# Altium project PCB_15122020_01CA.PrjPcb (part 7 of 7)

## Sheet LCD.SchDoc
size A4
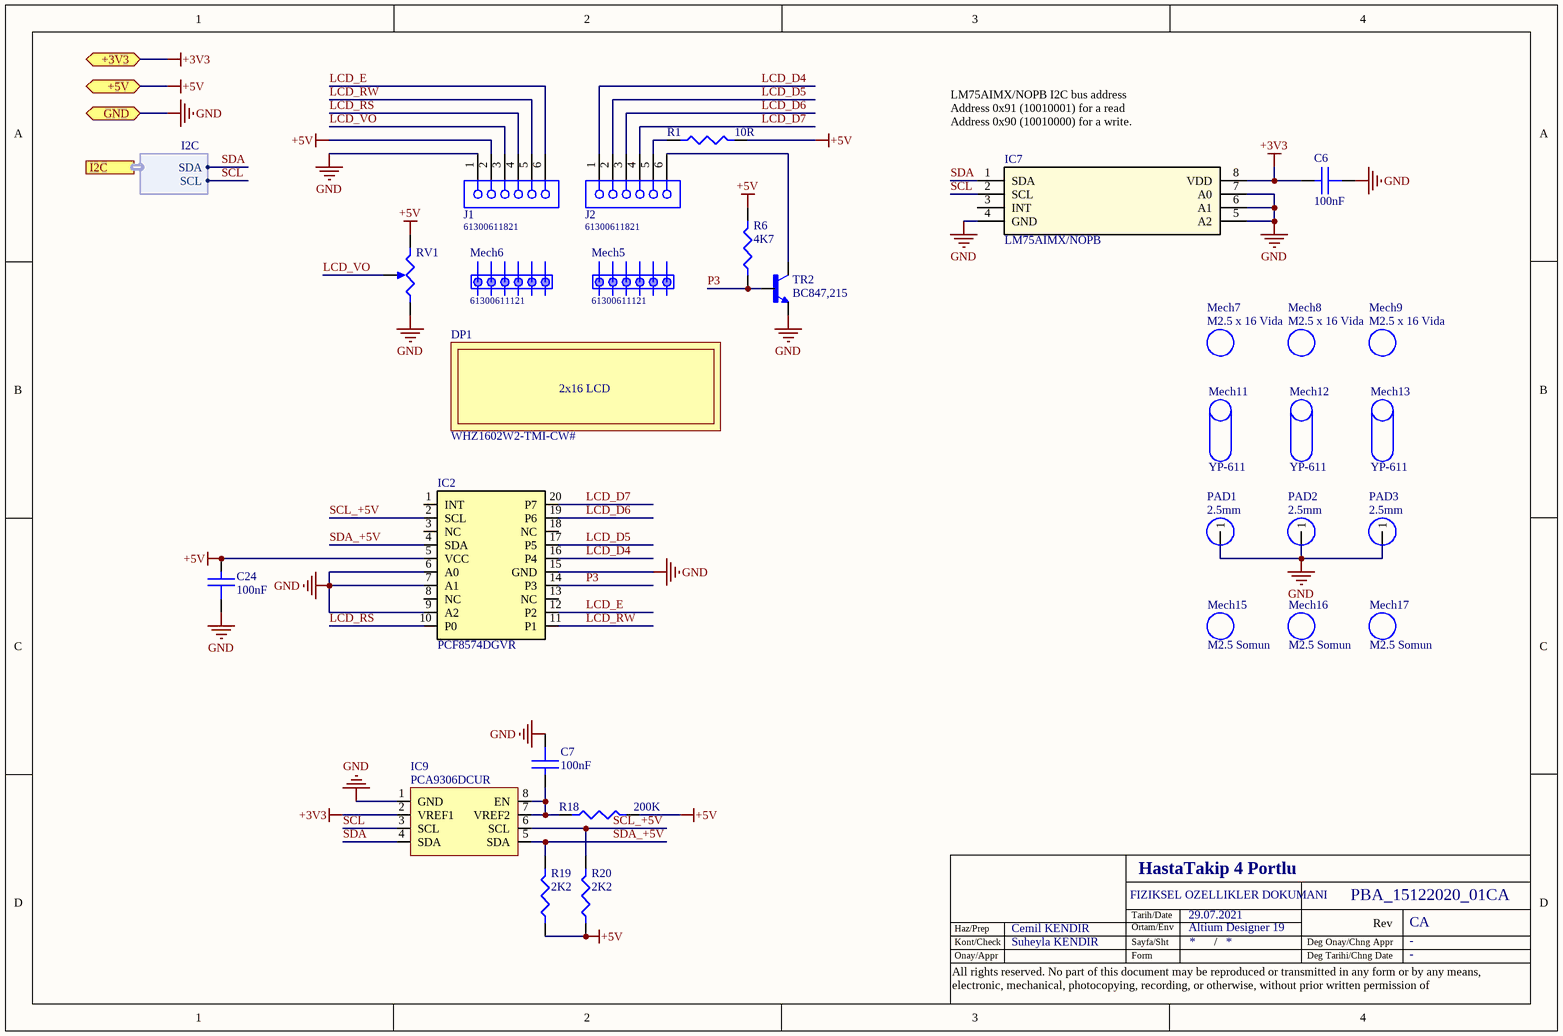
[diagram p6: LCD.SchDoc]

### Parts
C6  100nF  [C0603]
C7  100nF  [C0603]
C24  100nF  [C0603]
DP1  WHZ1602W2-TMI-CW#  [WHZ1602W2-TMI-CW#]
IC2  PCF8574DGVR  [DGV20]
IC7  LM75AIMX/NOPB  [SO08]
IC9  PCA9306DCUR  [SOP50P310X90-8N]
J1  61300611821  [61300611821]
J2  61300611821  [61300611821]
Mech5  61300611121  [61300611121]
Mech6  61300611121  [61300611121]
Mech7  M2.5 x 16 Vida  [M2.5 x 16]
Mech8  M2.5 x 16 Vida  [M2.5 x 16]
Mech9  M2.5 x 16 Vida  [M2.5 x 16]
Mech11  YP-611  [YP-611 - 11 mm]
Mech12  YP-611  [YP-611 - 11 mm]
Mech13  YP-611  [YP-611 - 11 mm]
Mech15  M2.5 Somun  [M2.5]
Mech16  M2.5 Somun  [M2.5]
Mech17  M2.5 Somun  [M2.5]
PAD1  2.5mm  [2.5mm x 5mm]
PAD2  2.5mm  [2.5mm x 5mm]
PAD3  2.5mm  [2.5mm x 5mm]
R1  10R  [R0603]
R6  4K7  [R0603]
R18  200K  [R0603]
R19  2K2  [R0603]
R20  2K2  [R0603]
RV1  L-KLS4-WH06-2A-103  [L-KLS4-WH06-2A-103]  (value not drawn)
TR2  BC847,215  [SOT23]

### Ports
+3V3 (bidir), +5V (bidir), GND (bidir), I2C (harness I2C)

### Harnesses
I2C: SCL, SDA

### Nets
+3V3: C6.1 IC7.8(VDD) IC9.2(VREF1) ; port +3V3
+5V: C24.1 IC2.5(VCC) J1.2 R1.2 R6.2 R18.2 R19.1 R20.1 RV1.2 ; port +5V
GND: C6.2 C7.2 C24.2 IC2.6(A0) IC2.7(A1) IC2.9(A2) IC2.15(GND) IC7.4(GND) IC7.5(A2) IC7.6(A1) IC7.7(A0) IC9.1(GND) J1.1 PAD1.1 PAD2.1 PAD3.1 RV1.1 TR2.2(E) ; port GND
LCD_D4: IC2.16(P4) J2.1
LCD_D5: IC2.17(P5) J2.2
LCD_D6: IC2.19(P6) J2.3
LCD_D7: IC2.20(P7) J2.4
LCD_E: IC2.12(P2) J1.6
LCD_RS: IC2.10(P0) J1.4
LCD_RW: IC2.11(P1) J1.5
LCD_VO: J1.3 RV1.3
P3: IC2.14(P3) R6.1 TR2.1(B)
SCL: IC7.2(SCL) IC9.3(SCL) ; port I2C.SCL  [project net GPIO03]
SCL_+5V: IC2.2(SCL) IC9.6(SCL) R20.2
SDA: IC7.1(SDA) IC9.4(SDA) ; port I2C.SDA  [project net GPIO02]
SDA_+5V: IC2.4(SDA) IC9.5(SDA) R19.2
NetC7_1: C7.1 IC9.7(VREF2) IC9.8(EN) R18.1
NetJ2_5: J2.5 R1.1
NetJ2_6: J2.6 TR2.3(C)

Not connected (* = marked no-connect by the designer): IC2 1(INT) 3(NC) 8(NC) 13(NC) 18(NC); IC7 3(INT)

### Notes on the sheet
- (near IC7) LM75AIMX/NOPB I2C bus address
  Address 0x91 (10010001) for a read
  Address 0x90 (10010000) for a write.
- Tarih/Date
- Haz/Prep
- Kont/Check
- Onay/Appr
- Sayfa/Sht
- Form
- Ortam/Env
- /
- Deg Tarihi/Chng Date
- Deg Onay/Chng Appr
- Rev
- All rights reserved. No part of this document may be reproduced or transmitted in any form or by any means, electronic, mechanical, photocopying, recording, or otherwise, without prior written permission of
- (in symbol WHZ1602W2-TMI-CW#) 2x16 LCD

### Library data of the parts
C6 C7 C24 = CC0603KRX7R8BB104: 100nF, 25V, X7R, 10%, 0603; Manufacturer: Yageo; Supplier 1: Digi-Key; Supplier Part Number 1: 311-1341-1-ND; Manufacturer Part Number: CC0603KRX7R8BB104; Stock 1: 10150433; Pricing 1: 1 = 0,10000, 10 = 0,04500, 50 = 0,02480, 100 = 0,02020, 500 = 0,01444, 1000 = 0,01134 (USD); RoHS: Yes; Mount: Surface Mount; Case/Package: 0603; Number of Pins: 2; Case Code (Imperial): 0603; Case Code (Metric): 1608; Min Operating Temperature: -55°C; Max Operating Temperature: 125°C; Capacitance: 100nF; Tolerance: 10%; Voltage Rating: 25V; Packaging: Tape and Reel; Package Quantity: 1; Voltage Rating (DC): 25V; Dielectric: X7R; Termination: SMD/SMT; Resistor Type: Ceramic; Voltage: 25V; Length: 1.6mm; Width: 0.8mm; Height: 0.8mm; Thickness: 0.035inch; Depth: 0.8mm; Radiation Hardening: No; REACH SVHC: Unknown; Lead Free: Lead Free; Halogen Free: Halogen Free; ComponentLink1URL: https://datasheet.ciiva.com/11786/0900766b80c10176-11786120.pdf?src-supplier=RSComponents; ComponentLink1Description: https://datasheet.ciiva.com/11786/0900766b80c10176-11786120.pdf?src-supplier=RSComponents; ComponentLink2URL: https://datasheet.ciiva.com/144/mlccorderingcode-144075.pdf?src-supplier=Digi-Key; ComponentLink2Description: https://datasheet.ciiva.com/144/mlccorderingcode-144075.pdf?src-supplier=Digi-Key; ComponentLink3URL: https://datasheet.ciiva.com/17434/upy-gphc-x7r-6-3v-to-50v-8-17434263.pdf?src-supplier=Avnet+Europe; ComponentLink3Description: https://datasheet.ciiva.com/17434/upy-gphc-x7r-6-3v-to-50v-8-17434263.pdf?src-supplier=Avnet+Europe; ComponentLink4URL: https://datasheet.ciiva.com/26829/getdatasheetpartid-403577-26829431.pdf?src-supplier=Verical; ComponentLink4Description: https://datasheet.ciiva.com/26829/getdatasheetpartid-403577-26829431.pdf?src-supplier=Verical; ComponentLink5URL: https://datasheet.ciiva.com/11587/upy-gphc-x7r-6-3v-to-50v-8-11587208.pdf?src-supplier=Avnet; ComponentLink5Description: https://datasheet.ciiva.com/11587/upy-gphc-x7r-6-3v-to-50v-8-11587208.pdf?src-supplier=Avnet; ComponentLink6URL: https://datasheet.ciiva.com/13389/upy-gphc-x7r-6-3v-to-50v-8-13389352.pdf?src-supplier=Mouser; ComponentLink6Description: https://datasheet.ciiva.com/13389/upy-gphc-x7r-6-3v-to-50v-8-13389352.pdf?src-supplier=Mouser; ComponentLink7URL: https://datasheet.ciiva.com/28450/1489800-28450584.pdf?src-supplier=Element14; ComponentLink7Description: https://datasheet.ciiva.com/28450/1489800-28450584.pdf?src-supplier=Element14; ComponentLink8URL: https://datasheet.ciiva.com/144/mlccorderingcode-144073.pdf?src-supplier=Digi-Key; ComponentLink8Description: https://datasheet.ciiva.com/144/mlccorderingcode-144073.pdf?src-supplier=Digi-Key; ComponentLink9URL: https://datasheet.ciiva.com/144/mlccorderingcode-144074.pdf?src-supplier=Digi-Key; ComponentLink9Description: https://datasheet.ciiva.com/144/mlccorderingcode-144074.pdf?src-supplier=Digi-Key; ComponentLink10URL: https://datasheet.ciiva.com/7978/1489800-7978155.pdf?src-supplier=Element14; ComponentLink10Description: https://datasheet.ciiva.com/7978/1489800-7978155.pdf?src-supplier=Element14; Category: Capasitor
DP1 = WHZ1602W2-TMI-CW#: LCD MOD 16*2 80X36X10MM LEDB.LIGHT WHITE; Manufacturer: Winstar; Category: Display; Manufacturer Part Number: WHZ1602W2-TMI-CW#; Supplier 1: Özdisan; Supplier Part Number 1: WHZ1602W2-TMI-CW#; Mount: Mekanik
IC2 = PCF8574DGVR: 8-bit 2.5- to 5.5-V I2C/SMBus I/O expander with interrupt 20-TVSOP -40 to 85; Manufacturer: Texas Instruments; Max Supply Voltage: 6V; Min Supply Voltage: 2.5V; Interface: I2C; Number of I/Os: 8; Max Frequency: 100kHz; Supplier 1: Digi-Key; Manufacturer Part Number: PCF8574DGVR; Stock 1: 34; Pricing 1: 1 = 1,67000, 10 = 1,50300, 25 = 1,41760 (USD); Mount: Surface Mount; Case/Package: TFSOP; Number of Pins: 20; Weight: 0.002123oz; Min Operating Temperature: -40°C; Max Operating Temperature: 85°C; Packaging: Tape and Reel; Package Quantity: 1; Frequency: 100kHz; Number of Outputs: 8; Lead Free: Lead Free; RoHS Compliant: Yes; ComponentLink1URL: https://datasheet.ciiva.com/26238/pcf8574-26238107.pdf?src-supplier=Avnet+Europe; ComponentLink1Description: https://datasheet.ciiva.com/26238/pcf8574-26238107.pdf?src-supplier=Avnet+Europe; ComponentLink2URL: https://datasheet.ciiva.com/1780/pcf8574-1780220.pdf?src-supplier=Digi-Key; ComponentLink2Description: https://datasheet.ciiva.com/1780/pcf8574-1780220.pdf?src-supplier=Digi-Key; ComponentLink3URL: https://datasheet.ciiva.com/1780/pcf8574-1780221.pdf?src-supplier=Digi-Key; ComponentLink3Description: https://datasheet.ciiva.com/1780/pcf8574-1780221.pdf?src-supplier=Digi-Key; ComponentLink4URL: https://datasheet.ciiva.com/1780/pcf8574-1780222.pdf?src-supplier=Digi-Key; ComponentLink4Description: https://datasheet.ciiva.com/1780/pcf8574-1780222.pdf?src-supplier=Digi-Key; ComponentLink5URL: https://octopart.com/click/track?ai=10049&ct=datasheets&sig=0255648&at=physicalpart&sid=370&ppid=469516&hlid=30058353&src-supplier=TI+store; ComponentLink5Description: https://octopart.com/click/track?ai=10049&ct=datasheets&sig=0255648&at=physicalpart&sid=370&ppid=469516&hlid=30058353&src-supplier=TI+store; ComponentLink6URL: http://datasheet.octopart.com/PCF8574DGVR-Texas-Instruments-datasheet-149749.pdf?src-supplier=Mouser; ComponentLink6Description: http://datasheet.octopart.com/PCF8574DGVR-Texas-Instruments-datasheet-149749.pdf?src-supplier=Mouser; ComponentLink7URL: http://datasheet.octopart.com/PCF8574DGVR-Texas-Instruments-datasheet-10256140.pdf?src-supplier=TI+store; ComponentLink7Description: http://datasheet.octopart.com/PCF8574DGVR-Texas-Instruments-datasheet-10256140.pdf?src-supplier=TI+store; ComponentLink8URL: http://datasheet.octopart.com/PCF8574DGVR-Texas-Instruments-datasheet-10255521.pdf?src-supplier=TI+store; ComponentLink8Description: http://datasheet.octopart.com/PCF8574DGVR-Texas-Instruments-datasheet-10255521.pdf?src-supplier=TI+store; ComponentLink9URL: http://datasheet.octopart.com/PCF8574DGVR-Texas-Instruments-datasheet-36835222.pdf?src-supplier=TI+store; ComponentLink9Description: http://datasheet.octopart.com/PCF8574DGVR-Texas-Instruments-datasheet-36835222.pdf?src-supplier=TI+store; ComponentLink10URL: http://datasheet.octopart.com/PCF8574DGVR-Texas-Instruments-datasheet-41216774.pdf?src-supplier=TI+store; ComponentLink10Description: http://datasheet.octopart.com/PCF8574DGVR-Texas-Instruments-datasheet-41216774.pdf?src-supplier=TI+store; ComponentLink11URL: http://sigma.octopart.com/49249898/technical_drawing/Texas-Instruments-PCF8574DGVR.pdf?src-supplier=TI+store; ComponentLink11Description: http://sigma.octopart.com/49249898/technical_drawing/Texas-Instruments-PCF8574DGVR.pdf?src-supplier=TI+store; ComponentLink12URL: http://datasheet.octopart.com/PCF8574DGVR-Texas-Instruments-datasheet-24033.pdf?src-supplier=Digi-Key; ComponentLink12Description: http://datasheet.octopart.com/PCF8574DGVR-Texas-Instruments-datasheet-24033.pdf?src-supplier=Digi-Key; ComponentLink13URL: http://datasheet.octopart.com/PCF8574DGVR-Texas-Instruments-datasheet-113726.pdf?src-supplier=Sierra+IC; ComponentLink13Description: http://datasheet.octopart.com/PCF8574DGVR-Texas-Instruments-datasheet-113726.pdf?src-supplier=Sierra+IC; ComponentLink14URL: http://datasheet.octopart.com/PCF8574DGVR-Texas-Instruments-datasheet-14134264.pdf?src-supplier=IIIC; ComponentLink14Description: http://datasheet.octopart.com/PCF8574DGVR-Texas-Instruments-datasheet-14134264.pdf?src-supplier=IIIC; ComponentLink15URL: http://datasheet.octopart.com/PCF8574DGVR-Texas-Instruments-datasheet-16079619.pdf?src-supplier=Factory+Futures; ComponentLink15Description: http://datasheet.octopart.com/PCF8574DGVR-Texas-Instruments-datasheet-16079619.pdf?src-supplier=Factory+Futures; ComponentLink16URL: http://datasheet.octopart.com/PCF8574DGVR-Texas-Instruments-datasheet-101600699.pdf?src-supplier=Upverter; ComponentLink16Description: http://datasheet.octopart.com/PCF8574DGVR-Texas-Instruments-datasheet-101600699.pdf?src-supplier=Upverter; Supplier Part Number 1: 296-17364-1-ND; Category: Integrated Circuits (ICs) Interface - I/O Expanders
IC7 = LM75AIMX/NOPB: SENSOR DIGITAL -55C-125C 8SOIC; Manufacturer: TI National Semiconductor; Interface: I2C,SMBus,2-Wire; Max Supply Voltage: 5.5V; Min Supply Voltage: 2.7V; Output Current: 1uA; Resolution: 9b; Operating Supply Current: 280uA; Quiescent Current: 500uA; Number of Bits: 9; Output Type: I2C,Digital; Supplier 1: Digi-Key; Manufacturer Part Number: LM75AIMX/NOPB; Stock 1: 21295; Pricing 1: 1 = 1,81000, 5 = 1,74200, 10 = 1,41600, 25 = 1,21960, 50 = 1,05640, 100 = 0,95830, 500 = 0,80586, 1000 = 0,71874 (USD); RoHS: Yes; Mount: Surface Mount; Case/Package: SOIC; Number of Pins: 8; Contact Plating: Tin; Min Operating Temperature: -55°C; Max Operating Temperature: 125°C; Packaging: Tape and Reel; Package Quantity: 2500; Max Supply Voltage (DC): 5.5V; Min Supply Voltage (DC): 2.7V; Radiation Hardening: No; REACH SVHC: No SVHC; Lead Free: Lead Free; ComponentLink1URL: https://datasheet.ciiva.com/3277/lm75a-3277942.pdf?src-supplier=Avnet; ComponentLink1Description: https://datasheet.ciiva.com/3277/lm75a-3277942.pdf?src-supplier=Avnet; ComponentLink2URL: https://datasheet.ciiva.com/46417/1841923-46417014.pdf?src-supplier=Element14; ComponentLink2Description: https://datasheet.ciiva.com/46417/1841923-46417014.pdf?src-supplier=Element14; ComponentLink3URL: https://datasheet.ciiva.com/6598/lm75a-6598537.pdf?src-supplier=Digi-Key; ComponentLink3Description: https://datasheet.ciiva.com/6598/lm75a-6598537.pdf?src-supplier=Digi-Key; ComponentLink4URL: https://datasheet.ciiva.com/6598/lm75a-6598538.pdf?src-supplier=Digi-Key; ComponentLink4Description: https://datasheet.ciiva.com/6598/lm75a-6598538.pdf?src-supplier=Digi-Key; ComponentLink5URL: https://datasheet.ciiva.com/6598/lm75a-6598539.pdf?src-supplier=Digi-Key; ComponentLink5Description: https://datasheet.ciiva.com/6598/lm75a-6598539.pdf?src-supplier=Digi-Key; Supplier Part Number 1: LM75AIMX/NOPBCT-ND; Category: Sensors, Transducers
IC9 = PCA9306DCUR: TEXAS INSTRUMENTS - PCA9306DCUR - 2 BIT VOLTAGE LEVEL TRANSLATOR VSSOP8; Number of Inputs: 2; Output Current: 64mA; Propagation Delay: 1.4ns; Min Supply Voltage: 0uV; Max Supply Voltage: 5V; Turn-On Delay Time: 1.2ns; Output Type: I2C; Supplier 1: Digi-Key; Supplier Part Number 1: 296-17988-1-ND; Manufacturer: Texas Instruments; Manufacturer Part Number: PCA9306DCUR; Stock 1: 19235; Pricing 1: 1 = 0,71000, 10 = 0,62700, 25 = 0,58920, 100 = 0,48070, 250 = 0,44652, 500 = 0,38000, 1000 = 0,30400 (USD); RoHS: Yes; Case/Package: VSSOP; Number of Pins: 8; Weight: 0.000339oz; Contact Plating: Gold; Min Operating Temperature: -40°C; Max Operating Temperature: 85°C; Packaging: Tape and Reel; Package Quantity: 1; Number of Channels: 2; Number of Outputs: 2; Logic Function: Translator; Number of Bits: 2; Termination: SMD/SMT; Length: 2.3mm; Width: 2mm; Height: 0.85mm; Radiation Hardening: No; REACH SVHC: No SVHC; Lead Free: Lead Free; ComponentLink1URL: https://datasheet.ciiva.com/36526/2030035-36526265.pdf?src-supplier=Jameco; ComponentLink1Description: https://datasheet.ciiva.com/36526/2030035-36526265.pdf?src-supplier=Jameco; ComponentLink2URL: https://datasheet.ciiva.com/1899/pca9306-1899329.pdf?src-supplier=Digi-Key; ComponentLink2Description: https://datasheet.ciiva.com/1899/pca9306-1899329.pdf?src-supplier=Digi-Key; ComponentLink3URL: https://datasheet.ciiva.com/1899/pca9306-1899330.pdf?src-supplier=Digi-Key; ComponentLink3Description: https://datasheet.ciiva.com/1899/pca9306-1899330.pdf?src-supplier=Digi-Key; ComponentLink4URL: https://datasheet.ciiva.com/1899/pca9306-1899331.pdf?src-supplier=Digi-Key; ComponentLink4Description: https://datasheet.ciiva.com/1899/pca9306-1899331.pdf?src-supplier=Digi-Key; ComponentLink5URL: https://datasheet.ciiva.com/14287/pca9306-14287462.pdf?src-supplier=Avnet; ComponentLink5Description: https://datasheet.ciiva.com/14287/pca9306-14287462.pdf?src-supplier=Avnet; ComponentLink6URL: https://datasheet.ciiva.com/1508/1815321-1508635.pdf?src-supplier=Element14; ComponentLink6Description: https://datasheet.ciiva.com/1508/1815321-1508635.pdf?src-supplier=Element14; ComponentLink7URL: https://datasheet.ciiva.com/1508/1862428-1508795.pdf?src-supplier=Element14; ComponentLink7Description: https://datasheet.ciiva.com/1508/1862428-1508795.pdf?src-supplier=Element14; Category: Integrated Circuits (ICs) Logic - Translators, Level Shifters
J1 J2 = 61300611821: WR-PHD Socket Header, THT, pitch 2.54mm, Single Row, Vertical, 6pin; Pin Number: 6; Gender: Female; Rated Current: 3A; Working Voltage: 250VAC; Withstanding Voltage: 500VAC; Contact Resistance: 20mOhm; ComponentLink1Description: Manufacturer; ComponentLink1URL: http://www.we-online.de; ComponentLink2Description: Datasheet; ComponentLink2URL: https://katalog.we-online.de/em/datasheet/6130xx11821.pdf; Part Number: 61300611821; Published Date: June 2019; Publisher: Wurth Elektronik; Pitch: 2.54mm; Operating Temperature: -40 to +125degC; Mounting Technology: THT; Packaging: Tray; Row Number: Single; Orientation: Vertical; Category: Connectors, Interconnects Rectangular Connectors
Mech5 Mech6 = 61300611121: WR-PHD Pin Header, THT, pitch 2.54mm, Single Row, Vertical, 6pin; Pin Number: 6; Gender: Male; Rated Current: 3A; Working Voltage: 250VAC; Withstanding Voltage: 500VAC; Contact Resistance: 20mOhm; ComponentLink1Description: Manufacturer; ComponentLink1URL: http://www.we-online.de; ComponentLink2Description: Datasheet; ComponentLink2URL: https://katalog.we-online.de/em/datasheet/6130xx11121.pdf; Part Number: 61300611121; Published Date: June 2019; Publisher: Wurth Elektronik; Pitch: 2.54mm; Operating Temperature: -40 to +105degC; Mounting Technology: THT; Packaging: Bag; Row Number: Single; Orientation: Vertical; Category: PinHeader
Mech7-Mech9 = M2.5 x 16 Vida: M2.5 x 16 YSB Vida; Category: Mechanical
Mech11-Mech13 = YP-611: Distance 2.5mmx11mm; Category: Mechanical
PAD1-PAD3 = 2.5mm x 5mm PAD: 5mm x 2.5mm Pad; Category: Pad
R1 = RC0603FR-0710RL: 10R ,%1 ,1/10 W ,0603; Manufacturer: Yageo; Tolerance: 1%; Voltage Rating (DC): 50V; Temperature Coefficient: 200ppm/°C; Power Rating: 100mW; Supplier 1: Digi-Key; Supplier Part Number 1: 311-10.0HRCT-ND; Manufacturer Part Number: RC0603FR-0710RL; Stock 1: 7663236; Pricing 1: 1 = 0,10000, 10 = 0,04100, 100 = 0,01690, 1000 = 0,00758, 2500 = 0,00658 (USD); RoHS: Yes; Case/Package: 0603; Number of Pins: 2; Case Code (Imperial): 0603; Case Code (Metric): 1608; Contact Plating: Tin,Matte; Min Operating Temperature: -55°C; Max Operating Temperature: 155°C; Packaging: Tape and Reel; Resistance: 10R; Resistor Type: Thick Film; Voltage Rating: 50V; Termination: SMD/SMT; Length: 1.6mm; Width: 0.8mm; Height: 0.45mm; Depth: 0.8mm; Radiation Hardening: No; REACH SVHC: No SVHC; Lead Free: Lead Free; Military Standard: Not; ComponentLink1URL: https://datasheet.ciiva.com/11808/0900766b80f96399-11808140.pdf?src-supplier=RSComponents; ComponentLink1Description: https://datasheet.ciiva.com/11808/0900766b80f96399-11808140.pdf?src-supplier=RSComponents; ComponentLink2URL: https://datasheet.ciiva.com/7746/443971-7746245.pdf?src-supplier=Element14; ComponentLink2Description: https://datasheet.ciiva.com/7746/443971-7746245.pdf?src-supplier=Element14; ComponentLink3URL: https://datasheet.ciiva.com/8891/pyu-rc0603-51-rohs-l-4-8891285.pdf?src-supplier=Avnet; ComponentLink3Description: https://datasheet.ciiva.com/8891/pyu-rc0603-51-rohs-l-4-8891285.pdf?src-supplier=Avnet; ComponentLink4URL: https://datasheet.ciiva.com/28386/pyu-rc0603-51-rohs-l-4-28386637.pdf?src-supplier=Avnet+Europe; ComponentLink4Description: https://datasheet.ciiva.com/28386/pyu-rc0603-51-rohs-l-4-28386637.pdf?src-supplier=Avnet+Europe; Category: Resistor
R6 = RC0603FR-074K7L: 4K7 ,%1 ,1/10 W ,0603; Manufacturer: Yageo; Resistance: 4.7kR; Tolerance: 1%; Voltage Rating (DC): 50V; Temperature Coefficient: 100ppm/°C; Power Rating: 100mW; Supplier 1: Digi-Key; Supplier Part Number 1: 311-4.70KHRCT-ND; Manufacturer Part Number: RC0603FR-074K7L; Stock 1: 5021901; Pricing 1: 1 = 0,10000, 10 = 0,02100, 100 = 0,00840, 1000 = 0,00379, 2500 = 0,00329 (USD); RoHS: Yes; Case/Package: 0603; Number of Pins: 2; Case Code (Imperial): 0603; Case Code (Metric): 1608; Min Operating Temperature: -55°C; Max Operating Temperature: 155°C; Packaging: Tape and Reel; Resistor Type: Thick Film; Voltage Rating: 50V; Termination: SMD/SMT; Length: 1.6mm; Width: 0.8mm; Height: 0.45mm; Depth: 0.8mm; Lead Pitch: 0.3mm; REACH SVHC: No SVHC; Lead Free: Lead Free; Military Standard: Not; ComponentLink1URL: https://datasheet.ciiva.com/15189/getdatasheetpartid-422754-15189760.pdf?src-supplier=Verical; ComponentLink1Description: https://datasheet.ciiva.com/15189/getdatasheetpartid-422754-15189760.pdf?src-supplier=Verical; ComponentLink2URL: https://datasheet.ciiva.com/22747/443971-22747528.pdf?src-supplier=Element14; ComponentLink2Description: https://datasheet.ciiva.com/22747/443971-22747528.pdf?src-supplier=Element14; ComponentLink3URL: https://datasheet.ciiva.com/7660/38590-7660794.pdf?src-supplier=Element14; ComponentLink3Description: https://datasheet.ciiva.com/7660/38590-7660794.pdf?src-supplier=Element14; ComponentLink4URL: https://datasheet.ciiva.com/7746/1868787-7746365.pdf?src-supplier=Element14; ComponentLink4Description: https://datasheet.ciiva.com/7746/1868787-7746365.pdf?src-supplier=Element14; ComponentLink5URL: https://datasheet.ciiva.com/46440/1868787-46440909.pdf?src-supplier=Element14; ComponentLink5Description: https://datasheet.ciiva.com/46440/1868787-46440909.pdf?src-supplier=Element14; ComponentLink6URL: https://datasheet.ciiva.com/7746/1738695-7746366.pdf?src-supplier=Element14; ComponentLink6Description: https://datasheet.ciiva.com/7746/1738695-7746366.pdf?src-supplier=Element14; Category: Resistor
R18 = RC0603FR-07200KL: 200K, %1, 1/10W, 0603; Manufacturer: Yageo; Resistance: 200kR; Tolerance: 1%; Temperature Coefficient: 100ppm/°C; Voltage Rating (DC): 50V; Power Rating: 100mW; Supplier 1: Digi-Key; Supplier Part Number 1: 311-200KHRCT-ND; Manufacturer Part Number: RC0603FR-07200KL; Stock 1: 1261743; Pricing 1: 1 = 0,10000, 10 = 0,02100, 100 = 0,00840, 1000 = 0,00379, 2500 = 0,00329 (USD); RoHS: Yes; Case/Package: 0603; Number of Pins: 2; Case Code (Metric): 1608; Case Code (Imperial): 0603; Min Operating Temperature: -55°C; Max Operating Temperature: 155°C; Packaging: Tape and Reel; Resistor Type: Thick Film; Voltage Rating: 50V; Package Quantity: 1; Number of Terminations: 2; Termination: SMD/SMT; Max Power Dissipation: 100mW; Features: Moisture Resistant; Length: 1.6mm; Width: 0.031inch; Height: 0.022inch; Depth: 0.8mm; Lead Free: Lead Free; REACH SVHC: No SVHC; Military Standard: Not; ComponentLink1URL: https://datasheet.ciiva.com/2453/pyu-r-int-thick-7-2453958.pdf?src-supplier=Digi-Key; ComponentLink1Description: https://datasheet.ciiva.com/2453/pyu-r-int-thick-7-2453958.pdf?src-supplier=Digi-Key; ComponentLink2URL: https://datasheet.ciiva.com/2453/pyu-r-int-thick-7-2453959.pdf?src-supplier=Digi-Key; ComponentLink2Description: https://datasheet.ciiva.com/2453/pyu-r-int-thick-7-2453959.pdf?src-supplier=Digi-Key; ComponentLink3URL: https://datasheet.ciiva.com/2453/pyu-r-int-thick-7-2453960.pdf?src-supplier=Digi-Key; ComponentLink3Description: https://datasheet.ciiva.com/2453/pyu-r-int-thick-7-2453960.pdf?src-supplier=Digi-Key; Category: Resistor
R19 R20 = RC0603FR-072K2L: 2K2, 1%, 0.1W, 0603; Manufacturer: Yageo; Resistance: 2.2kR; Power Rating: 100mW; Temperature Coefficient: 100ppm/°C; Voltage Rating: 50V; Supplier 1: Digi-Key; Supplier Part Number 1: 311-2.20KHRCT-ND; Manufacturer Part Number: RC0603FR-072K2L; Stock 1: 5062372; Pricing 1: 1 = 0,100000, 10 = 0,021000, 100 = 0,008400, 1000 = 0,003790, 2500 = 0,003290 (USD); RoHS: Yes; Case/Package: 0603; Case Code (Imperial): 0603; Case Code (Metric): 1608; Min Operating Temperature: -55°C; Max Operating Temperature: 155°C; Tolerance: 1%; Packaging: Tape and Reel; Package Quantity: 1; Termination: SMD/SMT; Resistor Type: Thick Film; Number of Terminations: 2; Max Power Dissipation: 100mW; Features: Moisture Resistant; Length: 1.6mm; Width: 0.031inch; Height: 0.022inch; Depth: 0.8mm; REACH SVHC: No SVHC; Lead Free: Lead Free; Military Standard: Not; ComponentLink1URL: https://datasheet.ciiva.com/46440/1868787-46440902.pdf?src-supplier=Element14; ComponentLink1Description: https://datasheet.ciiva.com/46440/1868787-46440902.pdf?src-supplier=Element14; ComponentLink2URL: https://datasheet.ciiva.com/2453/pyu-r-int-thick-7-2453943.pdf?src-supplier=Digi-Key; ComponentLink2Description: https://datasheet.ciiva.com/2453/pyu-r-int-thick-7-2453943.pdf?src-supplier=Digi-Key; ComponentLink3URL: https://datasheet.ciiva.com/7660/1868787-7660791.pdf?src-supplier=Element14; ComponentLink3Description: https://datasheet.ciiva.com/7660/1868787-7660791.pdf?src-supplier=Element14; ComponentLink4URL: https://datasheet.ciiva.com/2453/pyu-r-int-thick-7-2453944.pdf?src-supplier=Digi-Key; ComponentLink4Description: https://datasheet.ciiva.com/2453/pyu-r-int-thick-7-2453944.pdf?src-supplier=Digi-Key; ComponentLink5URL: https://datasheet.ciiva.com/2453/pyu-r-int-thick-7-2453945.pdf?src-supplier=Digi-Key; ComponentLink5Description: https://datasheet.ciiva.com/2453/pyu-r-int-thick-7-2453945.pdf?src-supplier=Digi-Key; ComponentLink6URL: https://datasheet.ciiva.com/7746/1738695-7746315.pdf?src-supplier=Element14; ComponentLink6Description: https://datasheet.ciiva.com/7746/1738695-7746315.pdf?src-supplier=Element14; ComponentLink7URL: https://datasheet.ciiva.com/7746/1738695-7746316.pdf?src-supplier=Element14; ComponentLink7Description: https://datasheet.ciiva.com/7746/1738695-7746316.pdf?src-supplier=Element14; ComponentLink8URL: https://datasheet.ciiva.com/46394/443971-46394958.pdf?src-supplier=Element14; ComponentLink8Description: https://datasheet.ciiva.com/46394/443971-46394958.pdf?src-supplier=Element14; Category: Resistor
RV1 = L-KLS4-WH06-2A-103: 10k TRIMPOT; Manufacturer: KLS ELECTRONIC; Category: Resistor- Trimpot; Manufacturer Part Number: L-KLS4-WH06-2A-103; Supplier 1: Özdisan; Supplier Part Number 1: L-KLS4-WH06-2A-103
TR2 = BC847,215: TRANS NPN 45V 0.1A SOT23; Manufacturer: Nexperia; Supplier 1: Digi-Key; Supplier Part Number 1: 1727-4855-1-ND; Manufacturer Part Number: BC847,215; Stock 1: 236151; Pricing 1: 1=0,14000, 10=0,12500, 100=0,06800, 500=0,04186, 1000=0,02854 (USD); RoHS: No; ComponentLink1URL: http://www.farnell.com/datasheets/1856333.pdf?src-supplier=Farnell; ComponentLink1Description: http://www.farnell.com/datasheets/1856333.pdf?src-supplier=Farnell; ComponentLink2URL: https://assets.nexperia.com/documents/data-sheet/BC847_SER.pdf?src-supplier=Digi-Key; ComponentLink2Description: https://assets.nexperia.com/documents/data-sheet/BC847_SER.pdf?src-supplier=Digi-Key; ComponentLink3URL: http://www.farnell.com/datasheets/1856333.pdf?src-supplier=Newark; ComponentLink3Description: http://www.farnell.com/datasheets/1856333.pdf?src-supplier=Newark; ComponentLink4URL: http://www.farnell.com/datasheets/1856333.pdf?src-supplier=Element14; ComponentLink4Description: http://www.farnell.com/datasheets/1856333.pdf?src-supplier=Element14; Category: Transistor-BJT
Mech15-Mech17 = M2.5 Somun: Category: Somun

## Nets that join several sheets
+3V3: USB_To_RS232 (17 pins), USB_TO_RS232/RS232_1 (7 pins), USB_TO_RS232/RS232_2 (7 pins), USB_TO_RS232/RS232_3 (7 pins), USB_TO_RS232/RS232_4 (7 pins), USB_Hub (17 pins), RaspberyConnector (21 pins), LCD (C6.1 IC7.8 IC9.2)
+5V: USB_TO_RS232/RS232_1 (C38_RS232_1.1 IC31_RS232_1.2), USB_TO_RS232/RS232_2 (C38_RS232_2.1 IC31_RS232_2.2), USB_TO_RS232/RS232_3 (C38_RS232_3.1 IC31_RS232_3.2), USB_TO_RS232/RS232_4 (C38_RS232_4.1 IC31_RS232_4.2), USB_Hub (8 pins), RaspberyConnector (15 pins), Power (R49.2 R50.2), LCD (9 pins)
CHASSIS: USB_Hub (CON10.Shell), RaspberyConnector (CON5.Shell CON9.20 SW1.3 SW2.3)
GND: USB_To_RS232 (28 pins), USB_TO_RS232/RS232_1 (9 pins), USB_TO_RS232/RS232_2 (9 pins), USB_TO_RS232/RS232_3 (9 pins), USB_TO_RS232/RS232_4 (9 pins), USB_Hub (60 pins), RaspberyConnector (97 pins), Power (R53.2 R54.2), LCD (18 pins)
GPIO02: RaspberyConnector (CON3.58), LCD (IC7.1 IC9.4)
GPIO03: RaspberyConnector (CON3.56), LCD (IC7.2 IC9.3)
nEXTRST: USB_Hub (R91.1), RaspberyConnector (CON3.100)
RS232_GND: USB_To_RS232 (CON1.5), USB_TO_RS232/RS232_1 (20 pins)
RS232_GND: USB_To_RS232 (CON6.5), USB_TO_RS232/RS232_2 (20 pins)
RS232_GND: USB_To_RS232 (CON7.5), USB_TO_RS232/RS232_3 (20 pins)
RS232_GND: USB_To_RS232 (CON8.5), USB_TO_RS232/RS232_4 (20 pins)
RS_CTS: USB_To_RS232 (CON1.8), USB_TO_RS232/RS232_1 (IC14_RS232_1.7 TVS3_RS232_1.1)
RS_CTS: USB_To_RS232 (CON6.8), USB_TO_RS232/RS232_2 (IC14_RS232_2.7 TVS3_RS232_2.1)
RS_CTS: USB_To_RS232 (CON7.8), USB_TO_RS232/RS232_3 (IC14_RS232_3.7 TVS3_RS232_3.1)
RS_CTS: USB_To_RS232 (CON8.8), USB_TO_RS232/RS232_4 (IC14_RS232_4.7 TVS3_RS232_4.1)
RS_DCD: USB_To_RS232 (CON1.1), USB_TO_RS232/RS232_1 (IC14_RS232_1.5 TVS1_RS232_1.2)
RS_DCD: USB_To_RS232 (CON6.1), USB_TO_RS232/RS232_2 (IC14_RS232_2.5 TVS1_RS232_2.2)
RS_DCD: USB_To_RS232 (CON7.1), USB_TO_RS232/RS232_3 (IC14_RS232_3.5 TVS1_RS232_3.2)
RS_DCD: USB_To_RS232 (CON8.1), USB_TO_RS232/RS232_4 (IC14_RS232_4.5 TVS1_RS232_4.2)
RS_DSR: USB_To_RS232 (CON1.6), USB_TO_RS232/RS232_1 (IC14_RS232_1.4 TVS1_RS232_1.1)
RS_DSR: USB_To_RS232 (CON6.6), USB_TO_RS232/RS232_2 (IC14_RS232_2.4 TVS1_RS232_2.1)
RS_DSR: USB_To_RS232 (CON7.6), USB_TO_RS232/RS232_3 (IC14_RS232_3.4 TVS1_RS232_3.1)
RS_DSR: USB_To_RS232 (CON8.6), USB_TO_RS232/RS232_4 (IC14_RS232_4.4 TVS1_RS232_4.1)
RS_DTR: USB_To_RS232 (CON1.4), USB_TO_RS232/RS232_1 (IC14_RS232_1.10 TVS4_RS232_1.2)
RS_DTR: USB_To_RS232 (CON6.4), USB_TO_RS232/RS232_2 (IC14_RS232_2.10 TVS4_RS232_2.2)
RS_DTR: USB_To_RS232 (CON7.4), USB_TO_RS232/RS232_3 (IC14_RS232_3.10 TVS4_RS232_3.2)
RS_DTR: USB_To_RS232 (CON8.4), USB_TO_RS232/RS232_4 (IC14_RS232_4.10 TVS4_RS232_4.2)
RS_RI: USB_To_RS232 (CON1.9), USB_TO_RS232/RS232_1 (IC14_RS232_1.8 TVS4_RS232_1.1)
RS_RI: USB_To_RS232 (CON6.9), USB_TO_RS232/RS232_2 (IC14_RS232_2.8 TVS4_RS232_2.1)
RS_RI: USB_To_RS232 (CON7.9), USB_TO_RS232/RS232_3 (IC14_RS232_3.8 TVS4_RS232_3.1)
RS_RI: USB_To_RS232 (CON8.9), USB_TO_RS232/RS232_4 (IC14_RS232_4.8 TVS4_RS232_4.1)
RS_RTS: USB_To_RS232 (CON1.7), USB_TO_RS232/RS232_1 (IC14_RS232_1.9 TVS2_RS232_1.1)
RS_RTS: USB_To_RS232 (CON6.7), USB_TO_RS232/RS232_2 (IC14_RS232_2.9 TVS2_RS232_2.1)
RS_RTS: USB_To_RS232 (CON7.7), USB_TO_RS232/RS232_3 (IC14_RS232_3.9 TVS2_RS232_3.1)
RS_RTS: USB_To_RS232 (CON8.7), USB_TO_RS232/RS232_4 (IC14_RS232_4.9 TVS2_RS232_4.1)
RS_RX: USB_To_RS232 (CON1.2), USB_TO_RS232/RS232_1 (IC14_RS232_1.6 TVS2_RS232_1.2)
RS_RX: USB_To_RS232 (CON6.2), USB_TO_RS232/RS232_2 (IC14_RS232_2.6 TVS2_RS232_2.2)
RS_RX: USB_To_RS232 (CON7.2), USB_TO_RS232/RS232_3 (IC14_RS232_3.6 TVS2_RS232_3.2)
RS_RX: USB_To_RS232 (CON8.2), USB_TO_RS232/RS232_4 (IC14_RS232_4.6 TVS2_RS232_4.2)
RS_TXD: USB_To_RS232 (CON1.3), USB_TO_RS232/RS232_1 (IC14_RS232_1.11 TVS3_RS232_1.2)
RS_TXD: USB_To_RS232 (CON6.3), USB_TO_RS232/RS232_2 (IC14_RS232_2.11 TVS3_RS232_2.2)
RS_TXD: USB_To_RS232 (CON7.3), USB_TO_RS232/RS232_3 (IC14_RS232_3.11 TVS3_RS232_3.2)
RS_TXD: USB_To_RS232 (CON8.3), USB_TO_RS232/RS232_4 (IC14_RS232_4.11 TVS3_RS232_4.2)
TTL_CTS: USB_To_RS232 (IC25.19), USB_TO_RS232/RS232_1 (IC32_RS232_1.11 R33_RS232_1.1)
TTL_CTS: USB_To_RS232 (IC25.29), USB_TO_RS232/RS232_2 (IC32_RS232_2.11 R33_RS232_2.1)
TTL_CTS: USB_To_RS232 (IC25.41), USB_TO_RS232/RS232_3 (IC32_RS232_3.11 R33_RS232_3.1)
TTL_CTS: USB_To_RS232 (IC25.54), USB_TO_RS232/RS232_4 (IC32_RS232_4.11 R33_RS232_4.1)
TTL_DCD: USB_To_RS232 (IC25.23), USB_TO_RS232/RS232_1 (IC32_RS232_1.14 R24_RS232_1.1)
TTL_DCD: USB_To_RS232 (IC25.33), USB_TO_RS232/RS232_2 (IC32_RS232_2.14 R24_RS232_2.1)
TTL_DCD: USB_To_RS232 (IC25.45), USB_TO_RS232/RS232_3 (IC32_RS232_3.14 R24_RS232_3.1)
TTL_DCD: USB_To_RS232 (IC25.58), USB_TO_RS232/RS232_4 (IC32_RS232_4.14 R24_RS232_4.1)
TTL_DSR: USB_To_RS232 (IC25.22), USB_TO_RS232/RS232_1 (IC32_RS232_1.13 R25_RS232_1.1)
TTL_DSR: USB_To_RS232 (IC25.32), USB_TO_RS232/RS232_2 (IC32_RS232_2.13 R25_RS232_2.1)
TTL_DSR: USB_To_RS232 (IC25.44), USB_TO_RS232/RS232_3 (IC32_RS232_3.13 R25_RS232_3.1)
TTL_DSR: USB_To_RS232 (IC25.57), USB_TO_RS232/RS232_4 (IC32_RS232_4.13 R25_RS232_4.1)
TTL_DTR: USB_To_RS232 (IC25.21), USB_TO_RS232/RS232_1 (IC33_RS232_1.5 R36_RS232_1.1)
TTL_DTR: USB_To_RS232 (IC25.30), USB_TO_RS232/RS232_2 (IC33_RS232_2.5 R36_RS232_2.1)
TTL_DTR: USB_To_RS232 (IC25.43), USB_TO_RS232/RS232_3 (IC33_RS232_3.5 R36_RS232_3.1)
TTL_DTR: USB_To_RS232 (IC25.55), USB_TO_RS232/RS232_4 (IC33_RS232_4.5 R36_RS232_4.1)
TTL_RI: USB_To_RS232 (IC25.24), USB_TO_RS232/RS232_1 (IC33_RS232_1.6 R37_RS232_1.1)
TTL_RI: USB_To_RS232 (IC25.34), USB_TO_RS232/RS232_2 (IC33_RS232_2.6 R37_RS232_2.1)
TTL_RI: USB_To_RS232 (IC25.46), USB_TO_RS232/RS232_3 (IC33_RS232_3.6 R37_RS232_3.1)
TTL_RI: USB_To_RS232 (IC25.59), USB_TO_RS232/RS232_4 (IC33_RS232_4.6 R37_RS232_4.1)
TTL_RTS: USB_To_RS232 (IC25.18), USB_TO_RS232/RS232_1 (IC33_RS232_1.3 R34_RS232_1.1)
TTL_RTS: USB_To_RS232 (IC25.28), USB_TO_RS232/RS232_2 (IC33_RS232_2.3 R34_RS232_2.1)
TTL_RTS: USB_To_RS232 (IC25.40), USB_TO_RS232/RS232_3 (IC33_RS232_3.3 R34_RS232_3.1)
TTL_RTS: USB_To_RS232 (IC25.53), USB_TO_RS232/RS232_4 (IC33_RS232_4.3 R34_RS232_4.1)
TTL_RX: USB_To_RS232 (IC25.17), USB_TO_RS232/RS232_1 (IC32_RS232_1.12 R32_RS232_1.1)
TTL_RX: USB_To_RS232 (IC25.27), USB_TO_RS232/RS232_2 (IC32_RS232_2.12 R32_RS232_2.1)
TTL_RX: USB_To_RS232 (IC25.39), USB_TO_RS232/RS232_3 (IC32_RS232_3.12 R32_RS232_3.1)
TTL_RX: USB_To_RS232 (IC25.52), USB_TO_RS232/RS232_4 (IC32_RS232_4.12 R32_RS232_4.1)
TTL_TX: USB_To_RS232 (IC25.16), USB_TO_RS232/RS232_1 (IC33_RS232_1.4 R35_RS232_1.1)
TTL_TX: USB_To_RS232 (IC25.26), USB_TO_RS232/RS232_2 (IC33_RS232_2.4 R35_RS232_2.1)
TTL_TX: USB_To_RS232 (IC25.38), USB_TO_RS232/RS232_3 (IC33_RS232_3.4 R35_RS232_3.1)
TTL_TX: USB_To_RS232 (IC25.48), USB_TO_RS232/RS232_4 (IC33_RS232_4.4 R35_RS232_4.1)
USB_1_N: USB_To_RS232 (CM3.2), USB_Hub (IC1.5 R52.2)
USB_1_P: USB_To_RS232 (CM3.3), USB_Hub (IC1.6 R42.2)
USB_N: USB_Hub (IC10.6 R41.2), RaspberyConnector (CON4.3)
USB_OTG_ID: USB_Hub (IC10.1 R104.1 R108.2), RaspberyConnector (CON4.1)
USB_P: USB_Hub (IC10.4 R40.2), RaspberyConnector (CON4.5)

## Assembly variants
AA: not fitted C2 C3 C6 C7 C24 C25 C29 C30 C31 C32 C33 C34 C35 C36 C37 C38_RS232_1 C38_RS232_2 C38_RS232_3 C38_RS232_4 C39_RS232_1 C39_RS232_2 C39_RS232_3 C39_RS232_4 C40 C41 C42 C44 C50 C51 C52 C53 C54 C55_RS232_1 C55_RS232_2 C55_RS232_3 C55_RS232_4 C56 C57 C58 C59 C60 C61 C62 C63 C119_RS232_1 C119_RS232_2 C119_RS232_3 C119_RS232_4 C120_RS232_1 C120_RS232_2 C120_RS232_3 C120_RS232_4 C121_RS232_1 C121_RS232_2 C121_RS232_3 C121_RS232_4 CM1 CM2 CM4 CON9 CON10 CON11 DP1 F1 F2 F3 F4 F5 FR1 FR2 FR3 H2 H4 IC1 IC2 IC4 IC6 IC7 IC9 IC11 IC15 IC31_RS232_1 IC31_RS232_2 IC31_RS232_3 IC31_RS232_4 IC32_RS232_1 IC32_RS232_2 IC32_RS232_3 IC32_RS232_4 IC33_RS232_1 IC33_RS232_2 IC33_RS232_3 IC33_RS232_4 J1 J2 J3 J4 J6 J15 LOGO1 LOGO2 LOGO3 LOGO4 LOGO 5 Mech5 Mech6 Mech7 Mech8 Mech9 Mech11 Mech12 Mech13 Mech15 Mech16 Mech17 PAD1 PAD2 PAD3 R1 R2 R3 R4 R5 R6 R7 R8 R9 R10 R11 R12 R13 R16 R17 R18 R19 R20 R40 R41 R43 R51 R58 R59 R60 R61 R65 R66 R67 R70 R71 R72 R73 R74 R75 R76 R77 R78 R91 RV1 TP3 TP4 TP5 TR2 TVS5 TVS6 TVS7 TVS8 VR1 XTAL2
AB: not fitted C25 C29 C63 CM2 CON11 F1 F2 F3 F4 F5 H2 H4 LOGO1 LOGO2 LOGO3 LOGO4 LOGO 5 R24_RS232_1 R24_RS232_2 R24_RS232_3 R24_RS232_4 R25_RS232_1 R25_RS232_2 R25_RS232_3 R25_RS232_4 R32_RS232_1 R32_RS232_2 R32_RS232_3 R32_RS232_4 R33_RS232_1 R33_RS232_2 R33_RS232_3 R33_RS232_4 R34_RS232_1 R34_RS232_2 R34_RS232_3 R34_RS232_4 R35_RS232_1 R35_RS232_2 R35_RS232_3 R35_RS232_4 R36_RS232_1 R36_RS232_2 R36_RS232_3 R36_RS232_4 R37_RS232_1 R37_RS232_2 R37_RS232_3 R37_RS232_4 R40 R41 R42 R51 R52 R56_RS232_1 R56_RS232_2 R56_RS232_3 R56_RS232_4 R57_RS232_1 R57_RS232_2 R57_RS232_3 R57_RS232_4 R58 R74 R76 R77 TP3 TP4 TP5 TVS6 VR1
AC: not fitted BAT1 C1 C2 C3 C4 C5 C6 C7 C24 C38_RS232_1 C38_RS232_2 C38_RS232_3 C38_RS232_4 C39_RS232_1 C39_RS232_2 C39_RS232_3 C39_RS232_4 C43 C55_RS232_1 C55_RS232_2 C55_RS232_3 C55_RS232_4 C74 C119_RS232_1 C119_RS232_2 C119_RS232_3 C119_RS232_4 C120_RS232_1 C120_RS232_2 C120_RS232_3 C120_RS232_4 C121_RS232_1 C121_RS232_2 C121_RS232_3 C121_RS232_4 CON3 CON4 CON5 CON9 D1 DP1 F1 F2 F3 F4 F5 H2 H4 IC2 IC3 IC4 IC5 IC6 IC7 IC9 IC10 IC12 IC13 IC31_RS232_1 IC31_RS232_2 IC31_RS232_3 IC31_RS232_4 IC32_RS232_1 IC32_RS232_2 IC32_RS232_3 IC32_RS232_4 IC33_RS232_1 IC33_RS232_2 IC33_RS232_3 IC33_RS232_4 J1 J2 J3 J4 J5 J6 J15 J16 J17 J18 J19 LED1 LED2 LOGO1 LOGO2 LOGO3 LOGO4 LOGO 5 Mech1 Mech2 Mech3 Mech4 Mech5 Mech6 Mech7 Mech8 Mech9 Mech11 Mech12 Mech13 Mech15 Mech16 Mech17 PAD1 PAD2 PAD3 R1 R6 R7 R8 R9 R10 R11 R12 R13 R14 R15 R16 R17 R18 R19 R20 R21 R22 R38 R39 R40 R41 R42 R44 R45 R46 R47 R48 R52 R63 R64 R75 R78 R91 R104 R108 RV1 SW1 SW2 TP3 TP4 TP5 TR2 TR3 TVS5 TVS12 XTAL1